# EasyEDA Pro project 久久派拓展板板框.epro

# Board PCB10
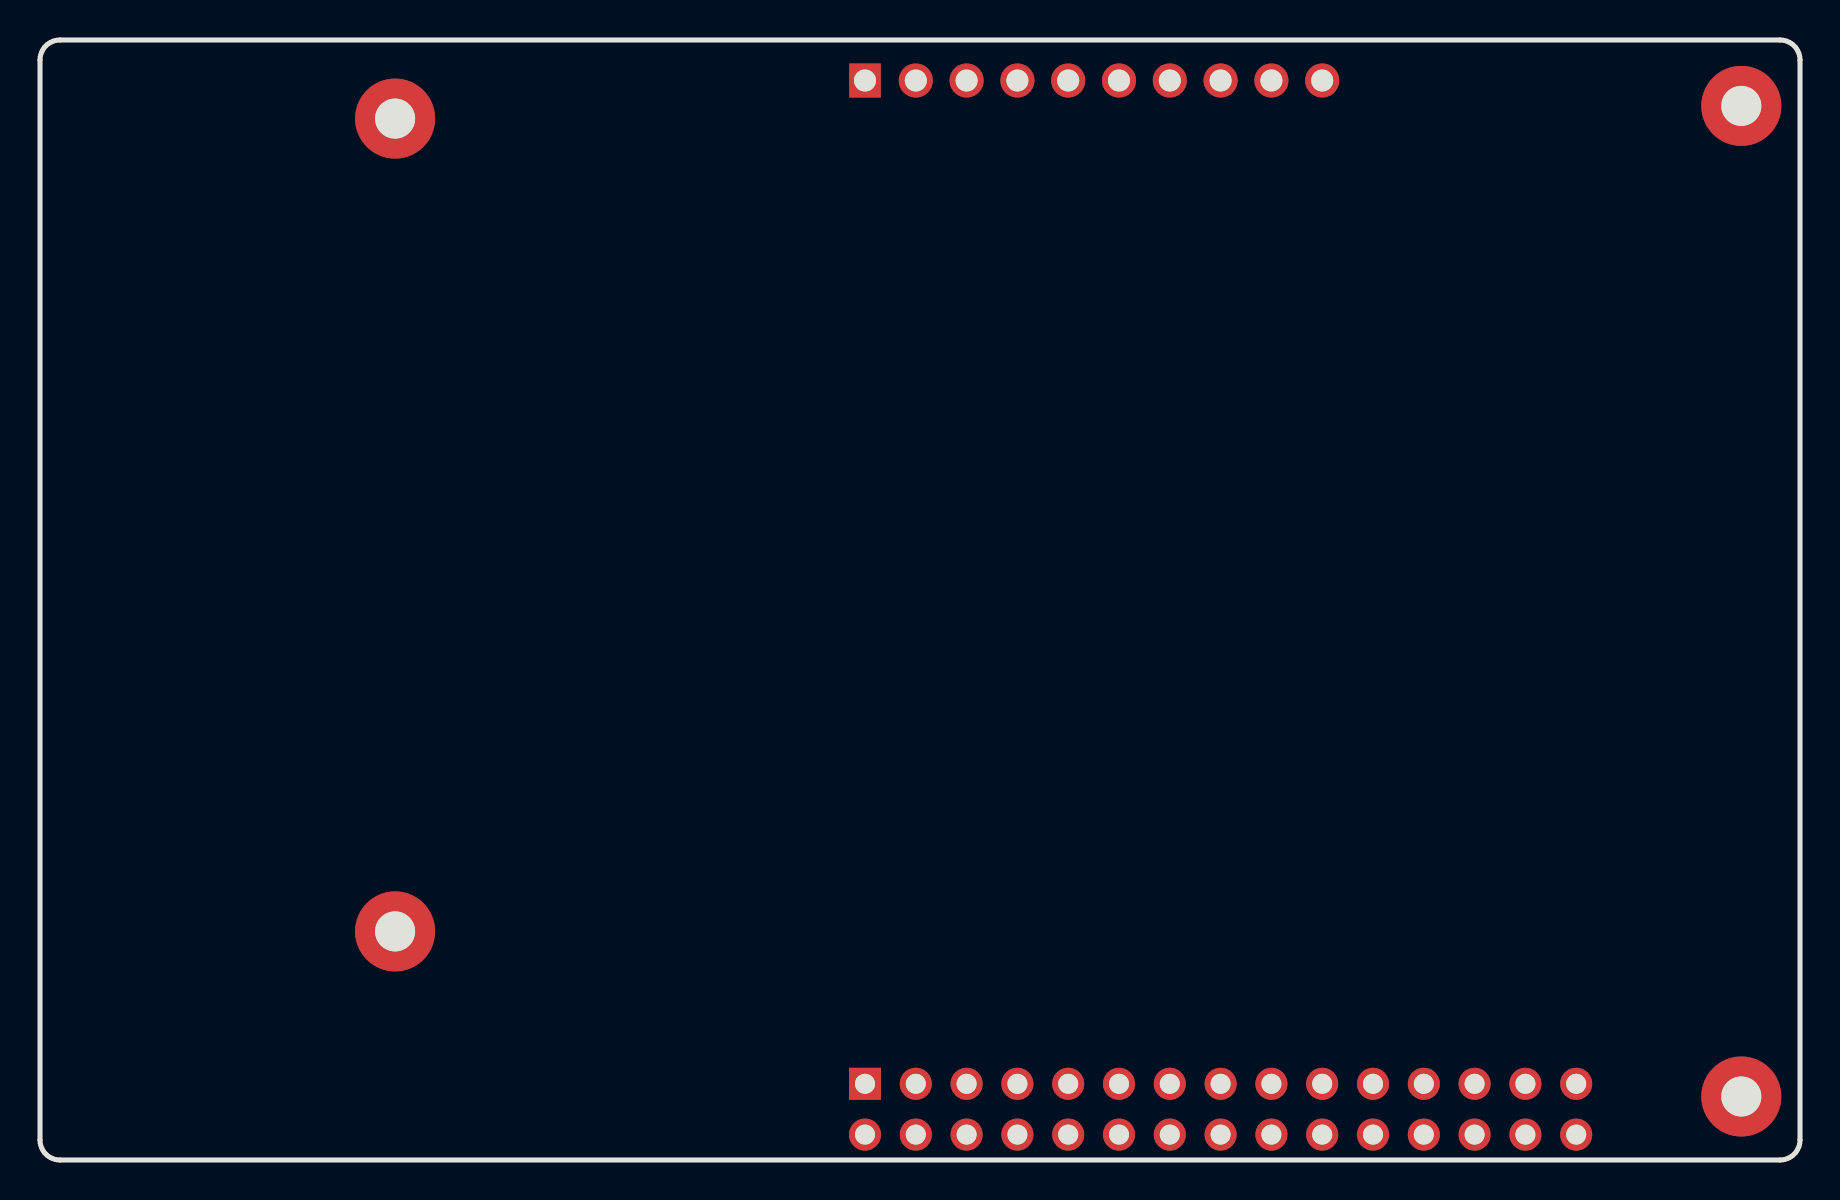
[diagram p0: board, top side]
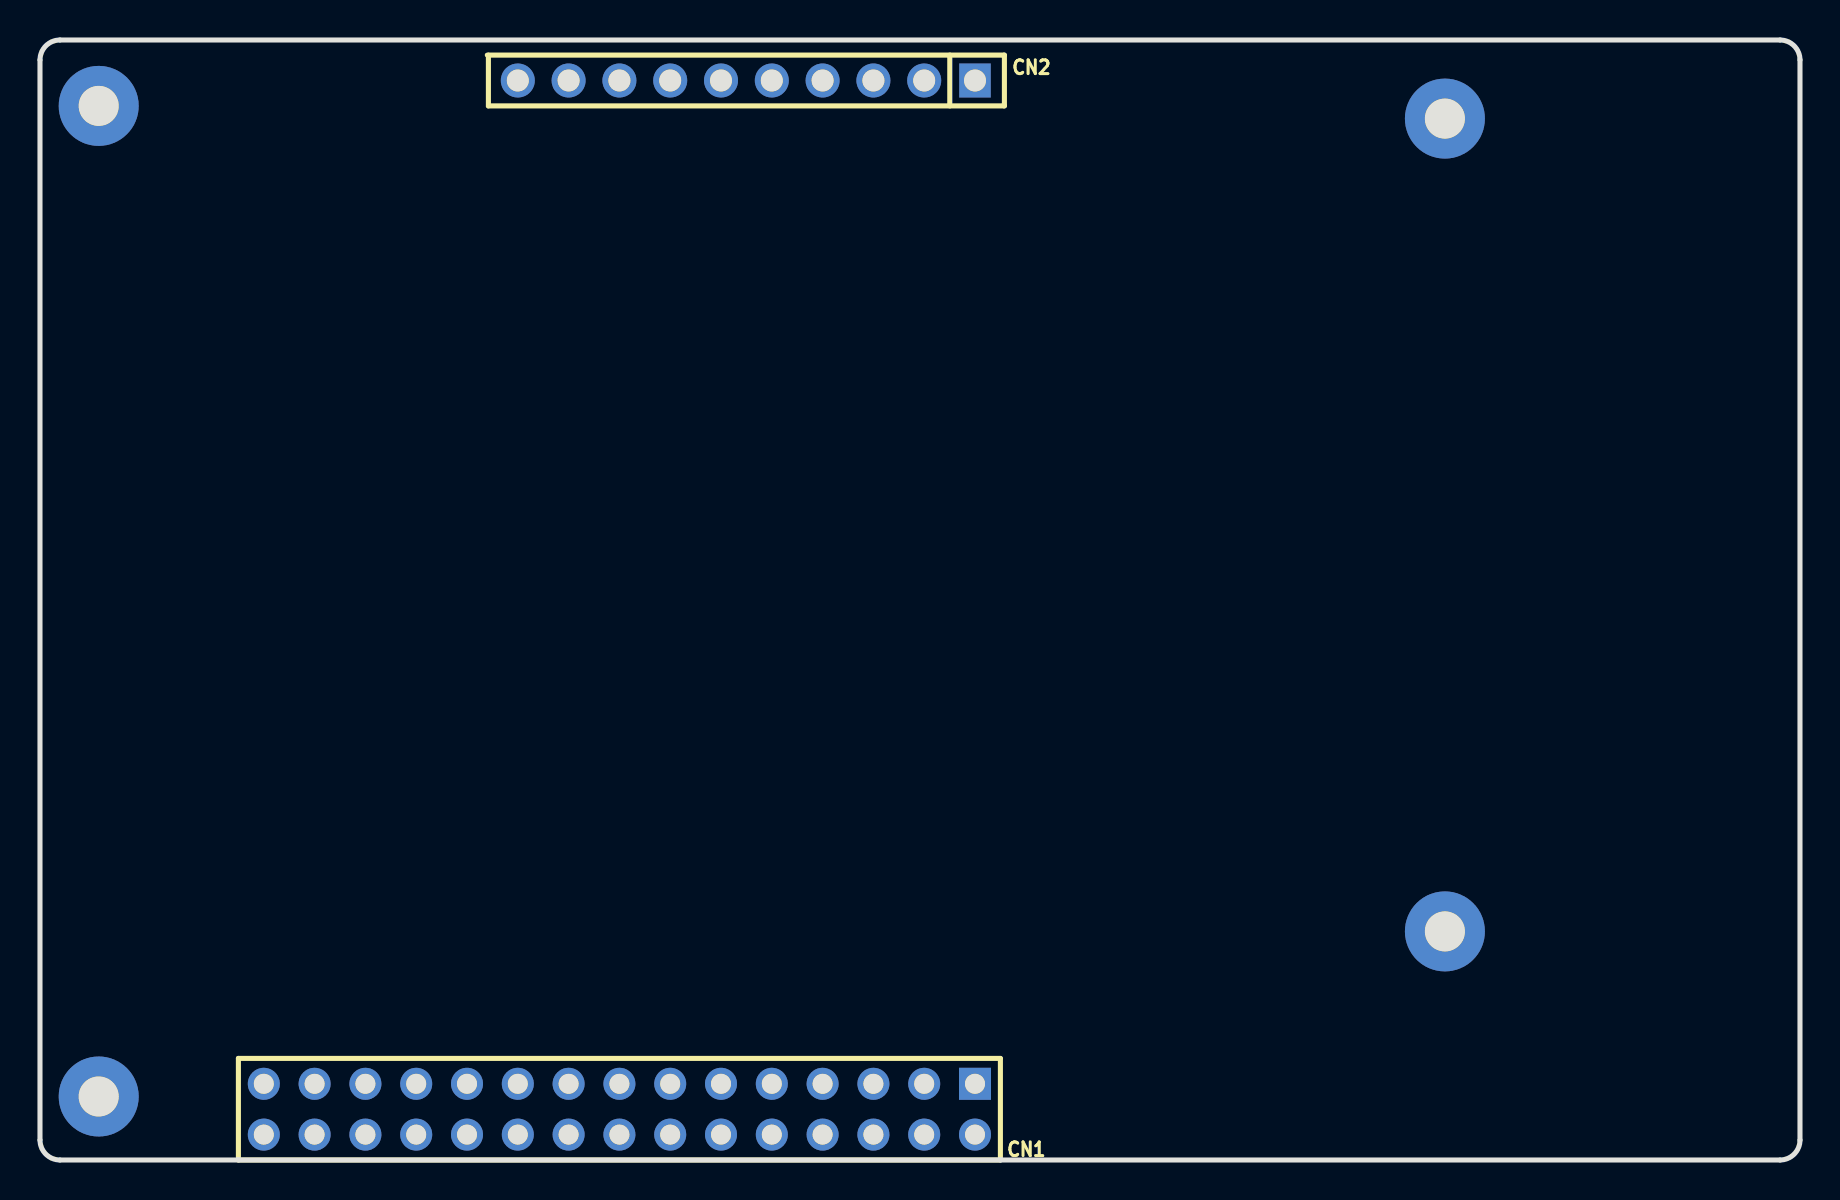
[diagram p1: board, bottom side, seen from below]

Outline 88 x 56 mm; copper layers: Top Layer, Bottom Layer. Coordinates in mm from the lower left corner of the outline.
Outline path: 0,55 0,1 arc(0.29,0.29) 1,0 87,0 arc(87.71,0.29) 88,1 88,55 arc(87.71,55.71) 87,56 1,56 arc(0.29,55.71) 0,55
Stack: Top Layer 0.035mm / Dielectric1 1.51mm FR4 er 4.5 / Bottom Layer 0.035mm

## Design rules (mm)
template: JLCPCB Capability(Two Layers Board)
spacing copperThickness1oz (default): track to track 0.102, other pairs 0.152 to 0.3
spacing copperThickness2oz: track to track 0.203, other pairs 0.152 to 0.3
track width copperThickness1oz (default): min 0.127, default 0.254, max 2.54
track width copperThickness2oz: min 0.203, default 0.254, max 2.54
differential pair differentialPair (default): width min 0.127, default 0.254, max 2.54; gap min 0.152, default 0.152
via viaSize (default): diameter min 0.5, default 0.61, max 10; hole min 0.3, default 0.305, max 6.3

## Placement (name value [footprint] x y rotation side)
CN1  X5521FV-2x15-C85D30-1150  [HDR-TH_30P-P2.54-V-F-R2-C15-S2.54-3]  59.03 2.54 0 bottom
CN2  KH-2.54FH-1X10P-H8.5  [HDR-TH_10P-P2.54-V-F]  52.68 53.97 0 bottom
NOREF  -  [Pad_e12]  85.06 52.7 0 top
NOREF#2  -  [Pad_e11]  85.06 3.17 0 top
NOREF#3  -  [Pad_e10]  17.75 11.43 0 top
NOREF#4  -  [Pad_e9]  17.75 52.07 0 top

## Footprints (pads in the part's own frame, mm; a bottom-side part is the same pattern mirrored in y, then rotated)
HDR-TH_10P-P2.54-V-F
  rect 1.575x1.7 hole 1.1: 1(-11.43,0)
  round 1.7 hole 1.1: 2(-8.89,0) 3(-6.35,0) 4(-3.81,0) 5(-1.27,0) 6(1.27,0) 7(3.81,0) 8(6.35,0) 9(8.89,0) 10(11.43,0)
HDR-TH_30P-P2.54-V-F-R2-C15-S2.54-3
  rect 1.6x1.6 hole 1: 1(-17.78,-1.27)
  round 1.6 hole 1: 2(-17.78,1.27) 3(-15.24,-1.27) 4(-15.24,1.27) 5(-12.7,-1.27) 6(-12.7,1.27) 7(-10.16,-1.27) 8(-10.16,1.27) 9(-7.62,-1.27) 10(-7.62,1.27) 11(-5.08,-1.27) 12(-5.08,1.27) 13(-2.54,-1.27) 14(-2.54,1.27) 15(0,-1.27) 16(0,1.27) 17(2.54,-1.27) 18(2.54,1.27) 19(5.08,-1.27) 20(5.08,1.27) 21(7.62,-1.27) 22(7.62,1.27) 23(10.16,-1.27) 24(10.16,1.27) 25(12.7,-1.27) 26(12.7,1.27) 27(15.24,-1.27) 28(15.24,1.27) 29(17.78,-1.27) 30(17.78,1.27)
Pad_e9
  round 4 hole 2: 1(0,0)
Pad_e10
  round 4 hole 2: 1(0,0)
Pad_e11
  round 4 hole 2: 1(0,0)
Pad_e12
  round 4 hole 2: 1(0,0)

## Nets
+5V: CN1.29
GND: CN1.2 CN1.19 CN1.20 CN1.30 CN2.2
P3V3_1: CN2.1
P3V3_2: CN1.1
CPU_ADC_IN0: CN2.4
CPU_ADC_IN1: CN2.5
CPU_ADC_IN2: CN2.7
CPU_ADC_IN3: CN2.9
CPU_ADC_IN4: CN2.3
CPU_ADC_IN5: CN2.6
CPU_ADC_IN6: CN2.8
CPU_ADC_IN7: CN2.10
CPU_CAN2_RX: CN1.10
CPU_CAN2_TX: CN1.8
CPU_CAN3_RX: CN1.14
CPU_CAN3_TX: CN1.12
CPU_I2C0_SCK: CN1.15
CPU_I2C0_SDA: CN1.17
CPU_I2C1_SCK: CN1.16
CPU_I2C1_SDA: CN1.18
CPU_SPI1_CLK: CN1.21
CPU_SPI1_CS: CN1.23
CPU_SPI1_MISO: CN1.25
CPU_SPI1_MOSI: CN1.27
CPU_SPI2_CLK: CN1.22
CPU_SPI2_CS: CN1.24
CPU_SPI2_MISO: CN1.26
CPU_SPI2_MOSI: CN1.28
CPU_TIM2_CH2: CN1.4
CPU_TIM2_CH3: CN1.6
CPU_UART0_RXD: CN1.5
CPU_UART0_TXD: CN1.3
CPU_UART1_RXD: CN1.9
CPU_UART1_TXD: CN1.7
CPU_UART2_RXD: CN1.13
CPU_UART2_TXD: CN1.11

Pads without a net: NOREF 1; NOREF#2 1; NOREF#3 1; NOREF#4 1
